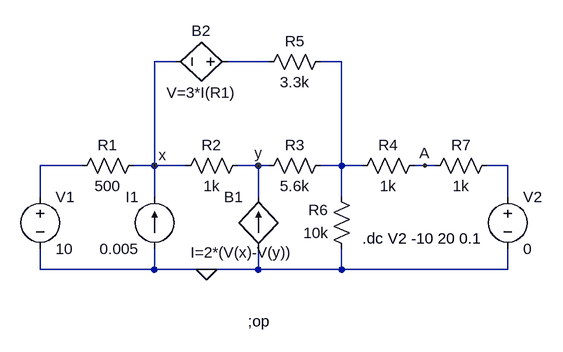
[diagram p0: schematic online lab02 task03.asc]
online lab02 task03.asc, the LTspice schematic file:
Version 4
SHEET 1 880 680
WIRE 208 0 176 0
WIRE 352 0 288 0
WIRE 464 0 432 0
WIRE 64 160 0 160
WIRE 176 160 176 0
WIRE 176 160 144 160
WIRE 224 160 176 160
WIRE 336 160 304 160
WIRE 352 160 336 160
WIRE 464 160 464 0
WIRE 464 160 432 160
WIRE 496 160 464 160
WIRE 592 160 576 160
WIRE 608 160 592 160
WIRE 720 160 688 160
WIRE 0 208 0 160
WIRE 176 208 176 160
WIRE 336 208 336 160
WIRE 464 208 464 160
WIRE 720 208 720 160
WIRE 0 320 0 288
WIRE 176 320 176 288
WIRE 176 320 0 320
WIRE 256 320 176 320
WIRE 336 320 336 288
WIRE 336 320 256 320
WIRE 464 320 464 288
WIRE 464 320 336 320
WIRE 720 320 720 288
WIRE 720 320 464 320
FLAG 256 320 0
FLAG 336 160 y
FLAG 176 160 x
FLAG 592 160 A
SYMBOL voltage 0 192 R0
WINDOW 123 0 0 Left 0
WINDOW 39 0 0 Left 0
SYMATTR InstName V1
SYMATTR Value 10
SYMBOL res 160 144 R90
WINDOW 0 0 56 VBottom 2
WINDOW 3 32 56 VTop 2
SYMATTR InstName R1
SYMATTR Value 500
SYMBOL res 320 144 R90
WINDOW 0 0 56 VBottom 2
WINDOW 3 32 56 VTop 2
SYMATTR InstName R2
SYMATTR Value 1k
SYMBOL res 448 144 R90
WINDOW 0 0 56 VBottom 2
WINDOW 3 32 56 VTop 2
SYMATTR InstName R3
SYMATTR Value 5.6k
SYMBOL res 592 144 R90
WINDOW 0 0 56 VBottom 2
WINDOW 3 32 56 VTop 2
SYMATTR InstName R4
SYMATTR Value 1k
SYMBOL res 448 -16 R90
WINDOW 0 0 56 VBottom 2
WINDOW 3 32 56 VTop 2
SYMATTR InstName R5
SYMATTR Value 3.3k
SYMBOL res 480 304 R180
WINDOW 0 36 76 Left 2
WINDOW 3 36 40 Left 2
SYMATTR InstName R6
SYMATTR Value 10k
SYMBOL current 176 288 R180
WINDOW 0 24 80 Left 2
WINDOW 3 24 0 Left 2
WINDOW 123 0 0 Left 0
WINDOW 39 0 0 Left 0
SYMATTR InstName I1
SYMATTR Value 0.005
SYMBOL bi 336 288 R180
WINDOW 0 24 80 Left 2
WINDOW 3 -52 -6 Left 2
SYMATTR InstName B1
SYMATTR Value I=2*(V(x)-V(y))
SYMBOL bv 304 0 R90
WINDOW 0 -32 56 VBottom 2
WINDOW 3 32 56 VTop 2
SYMATTR InstName B2
SYMATTR Value V=3*I(R1)
SYMBOL res 704 144 R90
WINDOW 0 0 56 VBottom 2
WINDOW 3 32 56 VTop 2
SYMATTR InstName R7
SYMATTR Value 1k
SYMBOL voltage 720 192 R0
WINDOW 123 0 0 Left 0
WINDOW 39 0 0 Left 0
SYMATTR InstName V2
SYMATTR Value 0
TEXT 320 400 Left 2 !;op
TEXT 496 272 Left 2 !.dc V2 -10 20 0.1

The netlist it stands for:
* online lab02 task03.asc
V1 N003 0 10
R1 x N003 500
R2 y x 1k
R3 N002 y 5.6k
R4 A N002 1k
R5 N002 N001 3.3k
R6 0 N002 10k
I1 0 x 0.005
B1 0 y I=2*(V(x)-V(y))
B2 N001 x V=3*I(R1)
R7 N004 A 1k
V2 N004 0 0
;op
.dc V2 -10 20 0.1
.backanno
.end